# EAGLE schematic M149C (EAGLE 6.6.0)
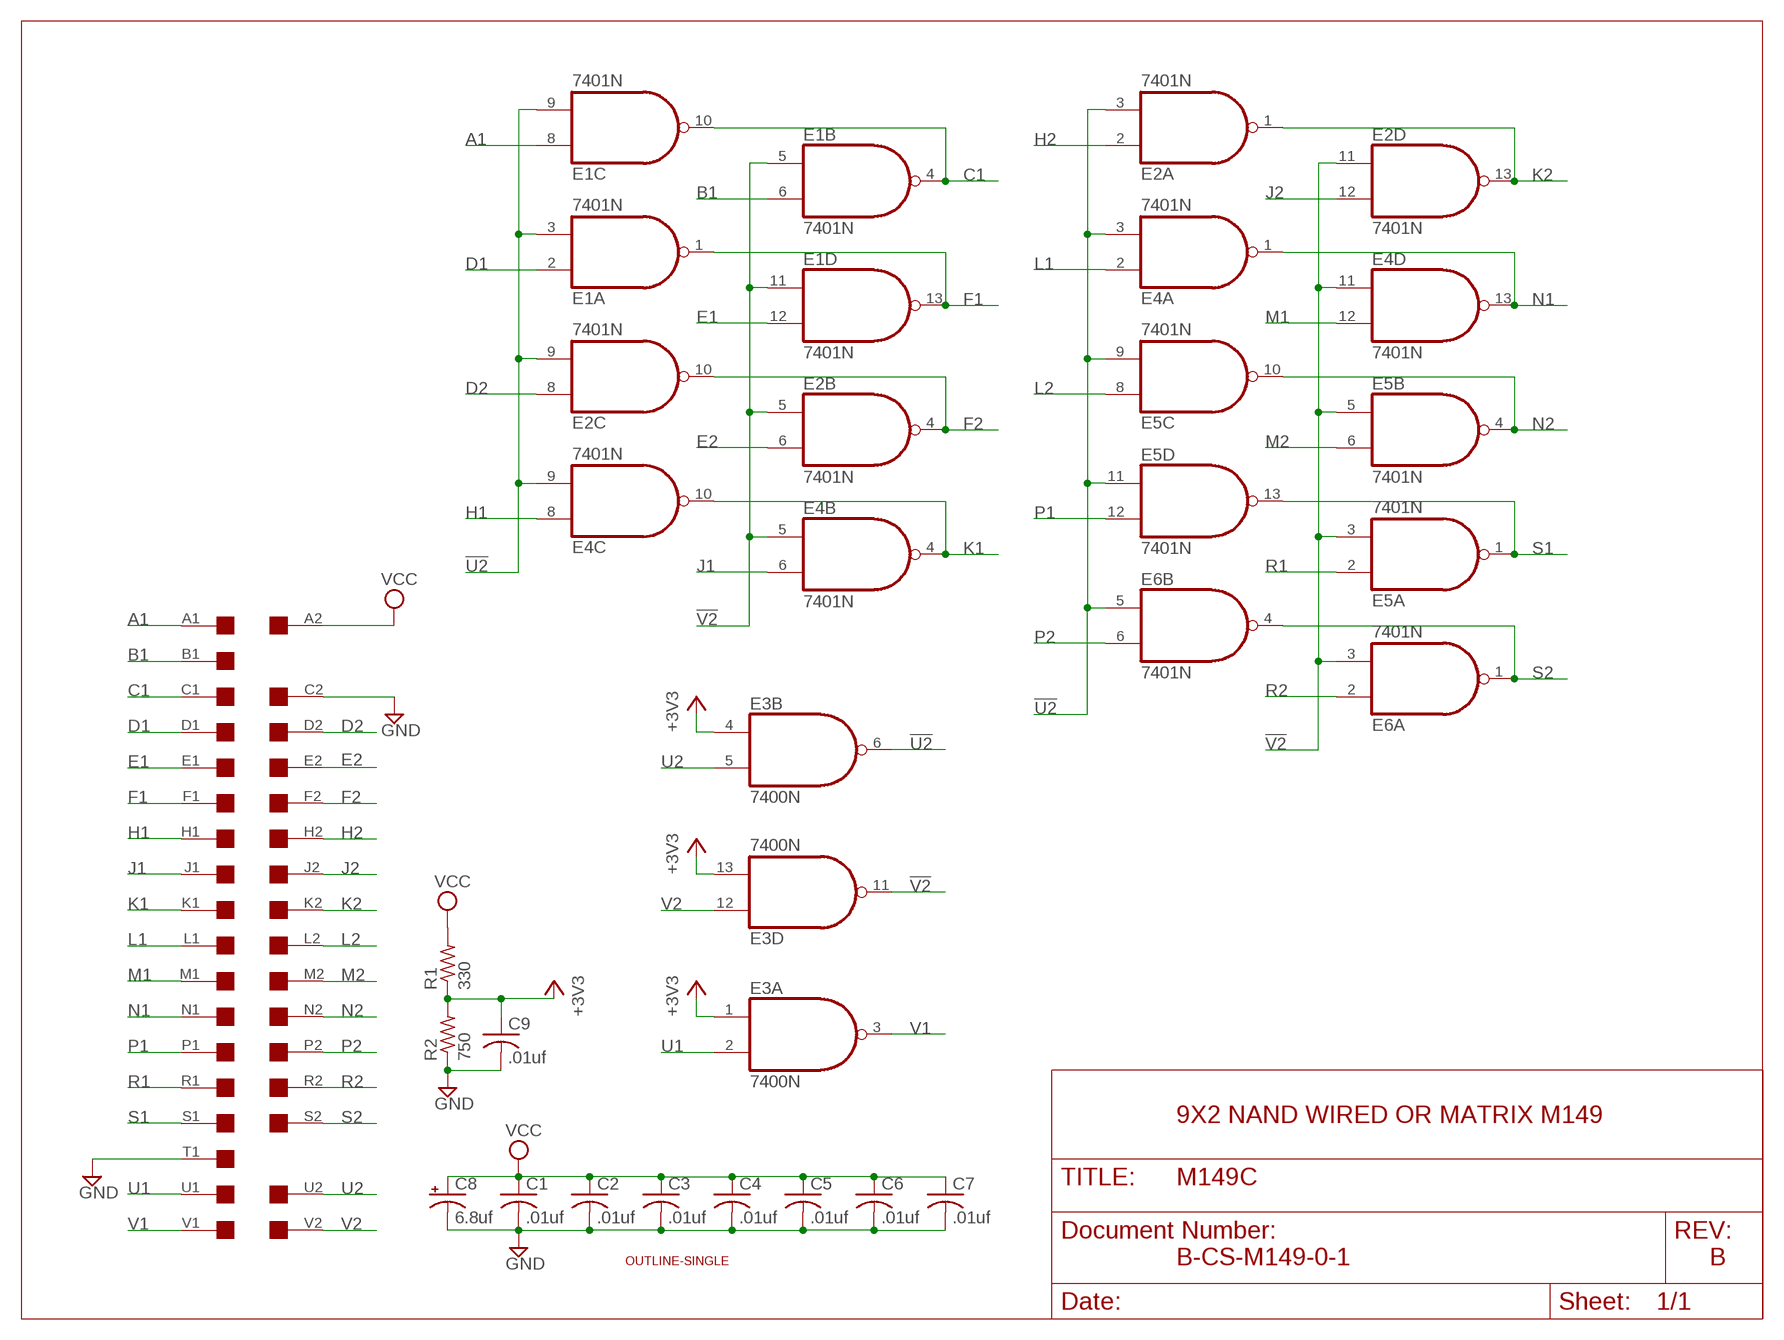
[diagram p0: schematic, sheet 1]

## Parts
C1  .01uf  C-US050-025X075  [C050-025X075]
C2  .01uf  C-US050-025X075  [C050-025X075]
C3  .01uf  C-US050-025X075  [C050-025X075]
C4  .01uf  C-US050-025X075  [C050-025X075]
C5  .01uf  C-US050-025X075  [C050-025X075]
C6  .01uf  C-US050-025X075  [C050-025X075]
C7  .01uf  C-US050-025X075  [C050-025X075]
C8  6.8uf  CPOL-USE15-5AXIAL  [E15-5]
C9  .01uf  C-US050-025X075  [C050-025X075]
E1  7401N  74LS01N  [DIL14]
E2  7401N  74LS01N  [DIL14]
E3  7400N  [DIL14]
E4  7401N  74LS01N  [DIL14]
E5  7401N  74LS01N  [DIL14]
E6  7401N  74LS01N  [DIL14]
R1  330  R-US_0207/10  [0207/10]
R2  750  R-US_0207/10  [0207/10]
U$1  SINGLE  [EDGE-CON2]
U$4  OUTLINE-SINGLE  [SINGLE]

## Nets
!U2: E1.3(A:I1) E1.9(C:I1) E2.3(A:I1) E2.9(C:I1) E3.6(B:O) E4.3(A:I1) E4.9(C:I1) E5.9(C:I1) E5.11(D:I0) E6.5(B:I0)
!V2: E1.5(B:I0) E1.11(D:I0) E2.5(B:I0) E2.11(D:I0) E3.11(D:O) E4.5(B:I0) E4.11(D:I0) E5.3(A:I1) E5.5(B:I0) E6.3(A:I1)
+3V3: C9.1 E3.1(A:I0) E3.4(B:I0) E3.13(D:I1) R1.1 R2.2
A1: E1.8(C:I0) U$1.A1
B1: E1.6(B:I1) U$1.B1
C1: E1.4(B:O) E1.10(C:O) U$1.C1
D1: E1.2(A:I0) U$1.D1
D2: E2.8(C:I0) U$1.D2
E1: E1.12(D:I1) U$1.E1
E2: E2.6(B:I1) U$1.E2
F1: E1.1(A:O) E1.13(D:O) U$1.F1
F2: E2.4(B:O) E2.10(C:O) U$1.F2
GND [Supply]: C1.2 C2.2 C3.2 C4.2 C5.2 C6.2 C7.2 C8.- C9.2 R2.1 U$1.C2 U$1.T1
H1: E4.8(C:I0) U$1.H1
H2: E2.2(A:I0) U$1.H2
J1: E4.6(B:I1) U$1.J1
J2: E2.12(D:I1) U$1.J2
K1: E4.4(B:O) E4.10(C:O) U$1.K1
K2: E2.1(A:O) E2.13(D:O) U$1.K2
L1: E4.2(A:I0) U$1.L1
L2: E5.8(C:I0) U$1.L2
M1: E4.12(D:I1) U$1.M1
M2: E5.6(B:I1) U$1.M2
N1: E4.1(A:O) E4.13(D:O) U$1.N1
N2: E5.4(B:O) E5.10(C:O) U$1.N2
P1: E5.12(D:I1) U$1.P1
P2: E6.6(B:I1) U$1.P2
R1: E5.2(A:I0) U$1.R1
R2: E6.2(A:I0) U$1.R2
S1: E5.1(A:O) E5.13(D:O) U$1.S1
S2: E6.1(A:O) E6.4(B:O) U$1.S2
U1: E3.2(A:I1) U$1.U1
U2: E3.5(B:I1) U$1.U2
V1: E3.3(A:O) U$1.V1
V2: E3.12(D:I0) U$1.V2
VCC [Supply]: C1.1 C2.1 C3.1 C4.1 C5.1 C6.1 C7.1 C8.+ R1.2 U$1.A2
Unconnected: E3.8(C:O) E3.9(C:I0) E3.10(C:I1) E6.8(C:I0) E6.9(C:I1) E6.10(C:O) E6.11(D:I0) E6.12(D:I1) E6.13(D:O) U$1.B2 U$1.T2

## Notes on the sheet
- 9X2 NAND WIRED OR MATRIX M149
- B-CS-M149-0-1 | B

## Power pins joined to a net without a drawn wire
GND: E1.7(P:GND) E2.7(P:GND) E3.7(P:GND) E4.7(P:GND) E5.7(P:GND) E6.7(P:GND)
VCC: E1.14(P:VCC) E2.14(P:VCC) E3.14(P:VCC) E4.14(P:VCC) E5.14(P:VCC) E6.14(P:VCC)

## Library data of the parts
C1-C7 C9 = rcl:C-US: CAPACITOR, American symbol
C8 = rcl:CPOL-US: POLARIZED CAPACITOR, American symbol
E1 E2 E4-E6 = 74xx-us:74*01: Quad 2-input NAND gate, open collector
E3 = 74xx-us:74*00: Quad 2-input NAND gate
R1 R2 = rcl:R-US_: RESISTOR, American symbol
U$1 = dec-con:SINGLE: Single-Height DEC board
U$4 = dec-con:OUTLINE-*: Board outlines for DEC boards.

## Net classes
1 Supply: width 0.813 mm